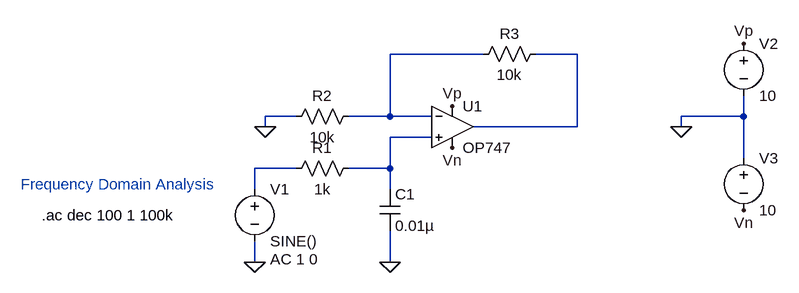
[diagram p0: schematic low_pass_filter.asc]
low_pass_filter.asc, the LTspice schematic file:
Version 4
SHEET 1 880 680
WIRE 240 32 96 32
WIRE 384 32 320 32
WIRE -48 128 -96 128
WIRE 96 128 96 32
WIRE 96 128 32 128
WIRE 160 128 96 128
WIRE 640 128 640 96
WIRE 640 128 544 128
WIRE -96 144 -96 128
WIRE 384 144 384 32
WIRE 384 144 224 144
WIRE 544 144 544 128
WIRE 160 160 96 160
WIRE 640 192 640 128
WIRE -48 208 -112 208
WIRE 96 208 96 160
WIRE 96 208 32 208
WIRE -112 240 -112 208
WIRE 96 240 96 208
WIRE -112 352 -112 320
WIRE 96 352 96 304
FLAG -96 144 0
FLAG -112 352 0
FLAG 544 144 0
FLAG 96 352 0
FLAG 640 16 Vp
FLAG 192 112 Vp
FLAG 640 272 Vn
FLAG 192 176 Vn
SYMBOL OpAmps\\OP747 192 80 R0
SYMATTR InstName U1
SYMBOL res 48 192 R90
WINDOW 0 0 56 VBottom 2
WINDOW 3 32 56 VTop 2
SYMATTR InstName R1
SYMATTR Value 1k
SYMBOL res 48 112 R90
WINDOW 0 0 56 VBottom 2
WINDOW 3 32 56 VTop 2
SYMATTR InstName R2
SYMATTR Value 10k
SYMBOL res 336 16 R90
WINDOW 0 0 56 VBottom 2
WINDOW 3 32 56 VTop 2
SYMATTR InstName R3
SYMATTR Value 10k
SYMBOL cap 80 240 R0
SYMATTR InstName C1
SYMATTR Value 0.01µ
SYMBOL voltage -112 224 R0
WINDOW 123 24 124 Left 2
WINDOW 39 0 0 Left 0
SYMATTR InstName V1
SYMATTR Value SINE()
SYMATTR Value2 AC 1 0
SYMBOL voltage 640 0 R0
WINDOW 123 0 0 Left 0
WINDOW 39 0 0 Left 0
SYMATTR InstName V2
SYMATTR Value 10
SYMBOL voltage 640 176 R0
WINDOW 123 0 0 Left 0
WINDOW 39 0 0 Left 0
SYMATTR InstName V3
SYMATTR Value 10
TEXT -440 280 Left 2 !.ac dec 100 1 100k
TEXT -472 232 Left 2 ;Frequency Domain Analysis

The netlist it stands for:
* low_pass_filter.asc
XU1 N003 N001 Vp Vn N002 OP747  ; pins In+ In- V+ V- OUT
R1 N003 N004 1k
R2 N001 0 10k
R3 N002 N001 10k
C1 N003 0 0.01µ
V1 N004 0 SINE() AC 1 0
V2 Vp 0 10
V3 0 Vn 10
.ac dec 100 1 100k
* Frequency Domain Analysis
.backanno
.end